# EAGLE design spider_tx4 (EAGLE 6.5.0)
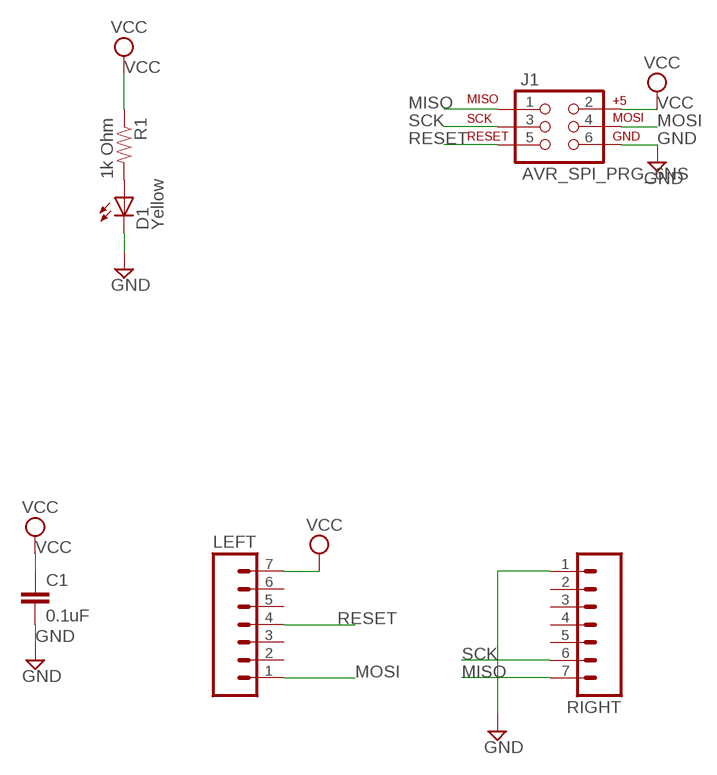
[diagram p0: schematic, sheet 1]

## Parts
C1  0.1uF  CAP1206  [1206]
D1  Yellow  LED-YELLOWLILYPAD  [LED-1206]
J1  AVR_SPI_PRG_6NS  [2X3-NS]
LEFT  M07  [1X07]
R1  1k Ohm  RESISTOR1206  [1206]
RIGHT  M07  [1X07]

## Nets
GND: C1.2 D1.C J1.6 RIGHT.1
MISO: J1.1 RIGHT.7
MOSI: J1.4 LEFT.1
N$14: D1.A R1.2
RESET: J1.5 LEFT.4
SCK: J1.3 RIGHT.6
VCC: C1.1 J1.2 LEFT.7 R1.1
Unconnected: LEFT.2 LEFT.3 LEFT.5 LEFT.6 RIGHT.2 RIGHT.3 RIGHT.4 RIGHT.5

## Library data of the parts
C1 = SparkFun-Passives:CAP: Capacitor Standard 0603 ceramic capacitor, and 0.1" leaded capacitor.
D1 = SparkFun-LED:LED-YELLOW: Yellow SMD LEDs LilyPad 1206- DIO-09909 0603- DIO-09003; PROD_ID: DIO-09909
J1 = SparkFun-Connectors:AVR_SPI_PRG_6: AVR ISP 6 Pin This is the reduced ISP connector for AVR programming. Common on Arduino. This footprint will take up less PCB space and can be used with a 10-pin to 6-pin adapter such as SKU: BOB-08508
LEFT RIGHT = SparkFun-Connectors:M07: Header 7 Standard 7-pin 0.1" header. Use with straight break away headers (SKU : PRT-00116), right angle break away headers (PRT-00553), swiss pins (PRT-00743), machine pins (PRT-00117), and female headers (PRT-00115). NOTES ON THE VARIANTS LOCK and LOCK_LONGPADS... This footprint was designed to help hold the alignment of a through-hole component (i.e. 7-pin header) while soldering it into place. You may notice that each hole has been shifted either up or down by 0.005 of an inch from it's more standard position (which is usually a perfectly straight line). This slight alteration caused the pins (the squares in the middle) to touch the edges of the holes. Because they are alternating, it causes a "brace" to hold the header in place. 0.005 has proven to be the perfect amount of "off-center" position when using our standard breakaway headers. Although looks a little odd when you look at the bare footprint, once you have a header in there, the alteration is very hard to notice. Also, if you push a header all the way into place, it is covered up entirely on the bottom side. This idea of altering the position of holes to aid alignment will be further integrated into the Sparkfun Library for other footprints. It can help hold any component with 3 or more connection pins.
R1 = SparkFun-Passives:RESISTOR: Resistor Basic schematic elements and footprints for 0603, 1206, and PTH resistors.

## Board
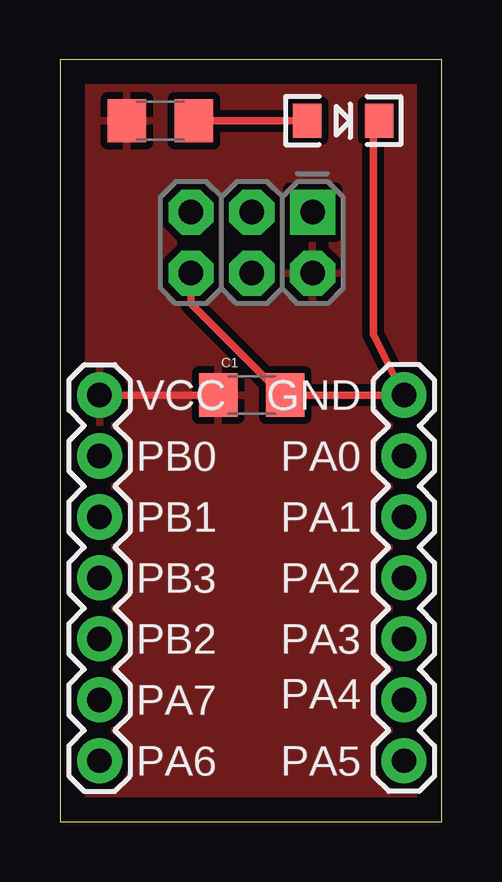
[diagram p1: board, top side]
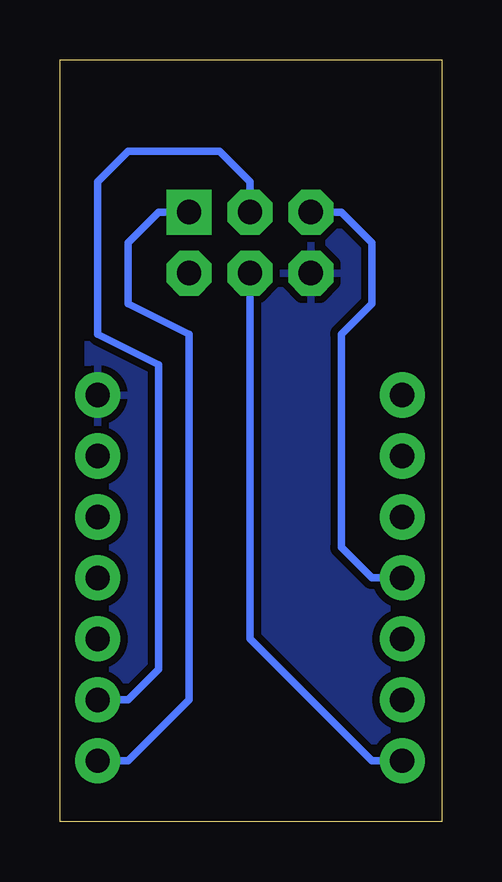
[diagram p2: board, bottom side, seen from below]

Size 15.93 x 31.74 mm. Coordinates in mm from the lower left corner, seen from the top.
Outline: 0,0 15.93,0 15.93,31.74 0,31.74 0,0
Copper layers (1*16): Top 0.035mm / dielectric 1.5mm / Bottom 0.035mm
Design rules "improved_12mil": minimum track width 12mil, minimum drill 0.8mm, track to track 12mil, track to pad 12mil, pad to pad 12mil, via to via 12mil, smd to smd 12mil, copper to edge 40mil, drill to drill 12mil, minimum pad ring 16mil, minimum via ring 16mil, stop-mask expansion 4mil, vias tented up to drill 0mil, thermal gap 12mil

### Footprints (pad centres in the part's own frame; a part is rotated, then mirrored left to right if it is on the bottom)
1206 = smd 1.6 x 1.8: 1 -1.4,0; 2 1.4,0
LED-1206 = smd 1.2 x 1.4: A -1.5,0; C 1.5,0
2X3-NS = drill 1.016 pad 1.88 square: 1 -2.54,-1.27 | drill 1.016 pad 1.88 octagon: 2 -2.54,1.27; 3 0,-1.27; 4 0,1.27; 5 2.54,-1.27; 6 2.54,1.27
1X07 = drill 1.016 pad 1.88: 1 0,0; 2 2.54,0; 3 5.08,0; 4 7.62,0; 5 10.16,0; 6 12.7,0; 7 15.24,0

### Placement (x,y rotation side)
C1  8,17.78 0 top
D1  11.81,29.21 0 top
J1  8,24.13 180 top
LEFT  1.65,2.54 90 top
R1  4.19,29.21 0 top
RIGHT  14.35,17.78 270 top

### Tracks (layer width: path | path; a pad name or v marks a point on that pad's centre or on a via)
GND
  Top 0.305: J1.6 5.46,21.59 9.27,17.78 C1.2 RIGHT.1 13.08,20.32 13.08,29.21 D1.C
  pour Bottom: -0.89,31.75 -0.89,0 16.89,0 16.89,31.75
MISO
  Bottom 0.305: RIGHT.7 13.08,2.54 10.54,5.08 10.54,20.32 13.08,21.59 13.08,24.13 11.81,25.4 J1.1
MOSI
  Bottom 0.305: LEFT.1 2.92,2.54 8,7.62 J1.4
N$14
  Top 0.305: 10.54,29.21 D1.A R1.2 5.46,29.21
RESET
  Bottom 0.305: LEFT.4 2.92,10.16 4.19,11.43 4.19,20.32 2.92,21.59 2.92,24.13 4.19,25.4 J1.5
SCK
  Bottom 0.305: RIGHT.6 13.08,5.08 11.81,6.35 11.81,19.05 14.35,20.32 14.35,26.67 13.08,27.94 9.27,27.94 8,26.67 J1.3
VCC
  Top 0.305: LEFT.7 C1.1
  pour Top: -0.89,31.75 -0.89,0 16.89,0 16.89,31.75

### Text on the board
tNames: VCC | GND | PB0 | PA0 | PB1 | PA1 | PB3 | PA2 | PB2 | PA3 | PA7 | PA4 | PA6 | PA5